# EAGLE design Left Ear Board (EAGLE 8.6.3)
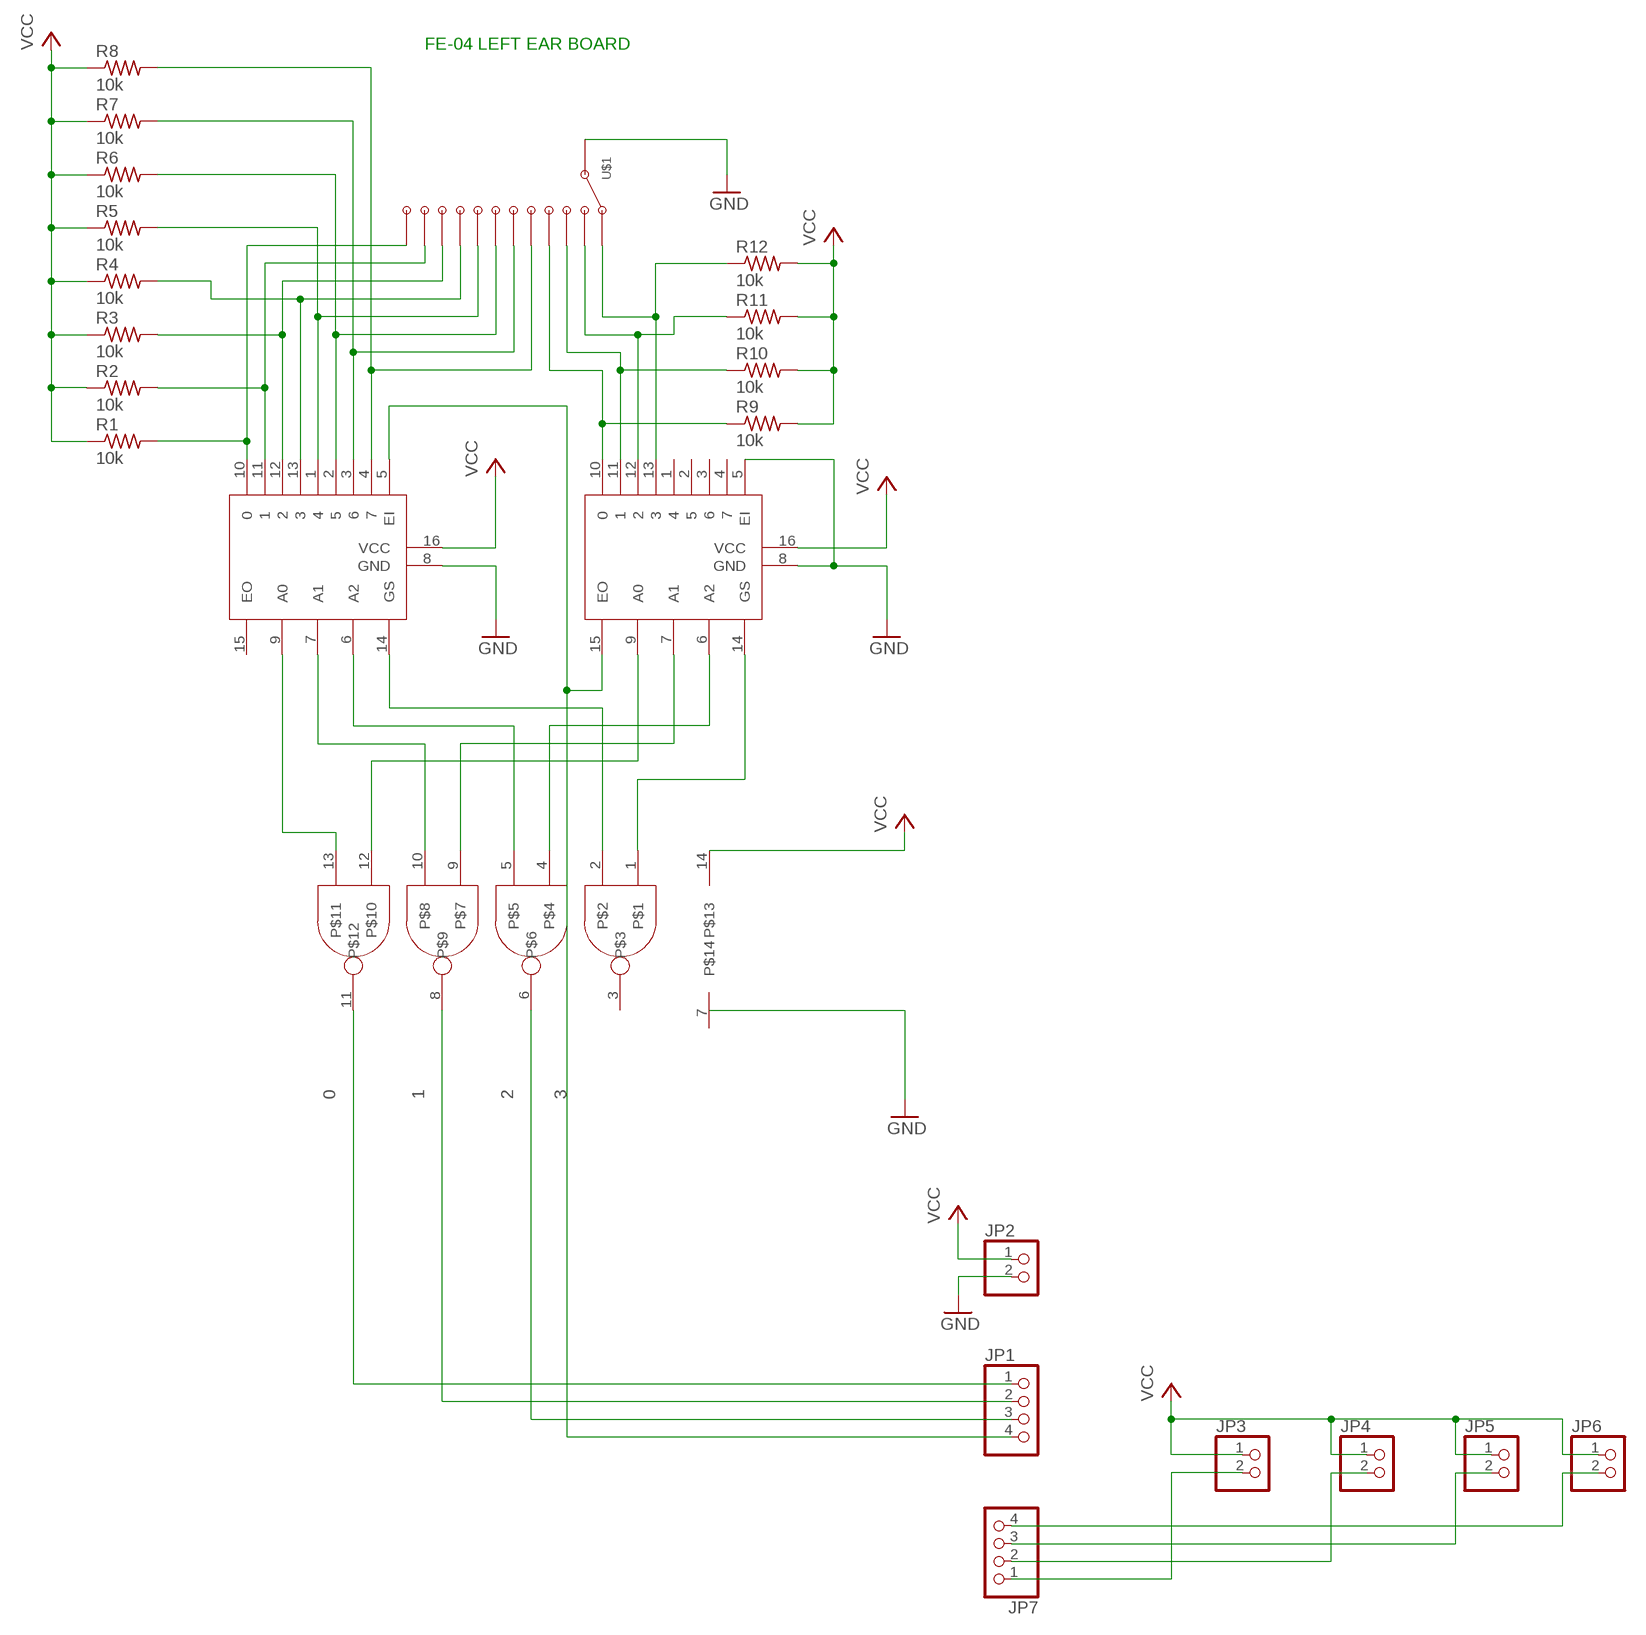
[diagram p0: schematic, sheet 1]

## Parts
JP1  PINHD-1X4  [1X04]
JP2  PINHD-1X2  [1X02]
JP3  PINHD-1X2  [1X02]
JP4  PINHD-1X2  [1X02]
JP5  PINHD-1X2  [1X02]
JP6  PINHD-1X2  [1X02]
JP7  PINHD-1X4  [1X04]
R1  10k  R-US_R0603  [R0603]
R2  10k  R-US_R0603  [R0603]
R3  10k  R-US_R0603  [R0603]
R4  10k  R-US_R0603  [R0603]
R5  10k  R-US_R0603  [R0603]
R6  10k  R-US_R0603  [R0603]
R7  10k  R-US_R0603  [R0603]
R8  10k  R-US_R0603  [R0603]
R9  10k  R-US_R0603  [R0603]
R10  10k  R-US_R0603  [R0603]
R11  10k  R-US_R0603  [R0603]
R12  10k  R-US_R0603  [R0603]
U$1  12-POSITION-ROTARY  [MC00L1NCQF]
U$2  SN74LS148D  [SOIC-16]
U$3  SN74LS148D  [SOIC-16]
U$4  QUAD_NAND  [SOIC-14]

## Nets
0: JP1.1 U$4.11
1: JP1.2 U$4.8
2: JP1.3 U$4.6
3: JP1.4 U$2.5(EI) U$3.15(EO)
GND: JP2.2 U$1.P$13(WIPER) U$2.8(GND) U$3.5(EI) U$3.8(GND)
N$1: R1.2 U$1.P$12(PIN12) U$2.10
N$2: U$2.9(A0) U$4.13
N$3: U$3.9(A0) U$4.12
N$4: U$2.7(A1) U$4.10
N$5: U$3.7(A1) U$4.9
N$6: U$2.6(A2) U$4.5
N$7: U$3.6(A2) U$4.4
N$8: U$2.14(GS) U$4.2
N$9: U$3.14(GS) U$4.1
N$10: R9.1 U$1.P$4(PIN4) U$3.10
N$11: R10.1 U$1.P$3(PIN3) U$3.11
N$12: R11.1 U$1.P$2(PIN2) U$3.12
N$13: R12.1 U$1.P$1(PIN1) U$3.13
N$14: R2.2 U$1.P$11(PIN11) U$2.11
N$15: R3.2 U$1.P$10(PIN10) U$2.12
N$16: R4.2 U$1.P$9(PIN9) U$2.13
N$17: R5.2 U$1.P$8(PIN8) U$2.1
N$18: R6.2 U$1.P$7(PIN7) U$2.2
N$19: R7.2 U$1.P$6(PIN6) U$2.3
N$20: R8.2 U$1.P$5(PIN5) U$2.4
N$21: JP3.2 JP7.1
N$22: JP4.2 JP7.2
N$23: JP5.2 JP7.3
N$24: JP6.2 JP7.4
VCC: JP2.1 JP3.1 JP4.1 JP5.1 JP6.1 R1.1 R2.1 R3.1 R4.1 R5.1 R6.1 R7.1 R8.1 R9.2 R10.2 R11.2 R12.2 U$2.16(VCC) U$3.16(VCC) U$4.14
Unconnected: U$2.15(EO) U$3.1 U$3.2 U$3.3 U$3.4 U$4.3 U$4.7

## Notes on the sheet
- FE-04 LEFT EAR BOARD

## Library data of the parts
JP1 JP7 = pinhead:PINHD-1X4: PIN HEADER
JP2-JP6 = pinhead:PINHD-1X2: PIN HEADER
R1-R12 = rcl:R-US_: RESISTOR, American symbol; PARTNO: ERJ-3EKF2201V
U$1 = FormE:12-POSITION-ROTARY: 12 Position Rotary Switch https://www.digikey.com/product-detail/en/c-k/MC00L1NCQF/CKN11089-ND/3754082
U$2 U$3 = FormE:SN74LS148D: IC PRIORITY ENCODER 8-3L 16-SOIC
U$4 = FormE:QUAD_NAND

## Board
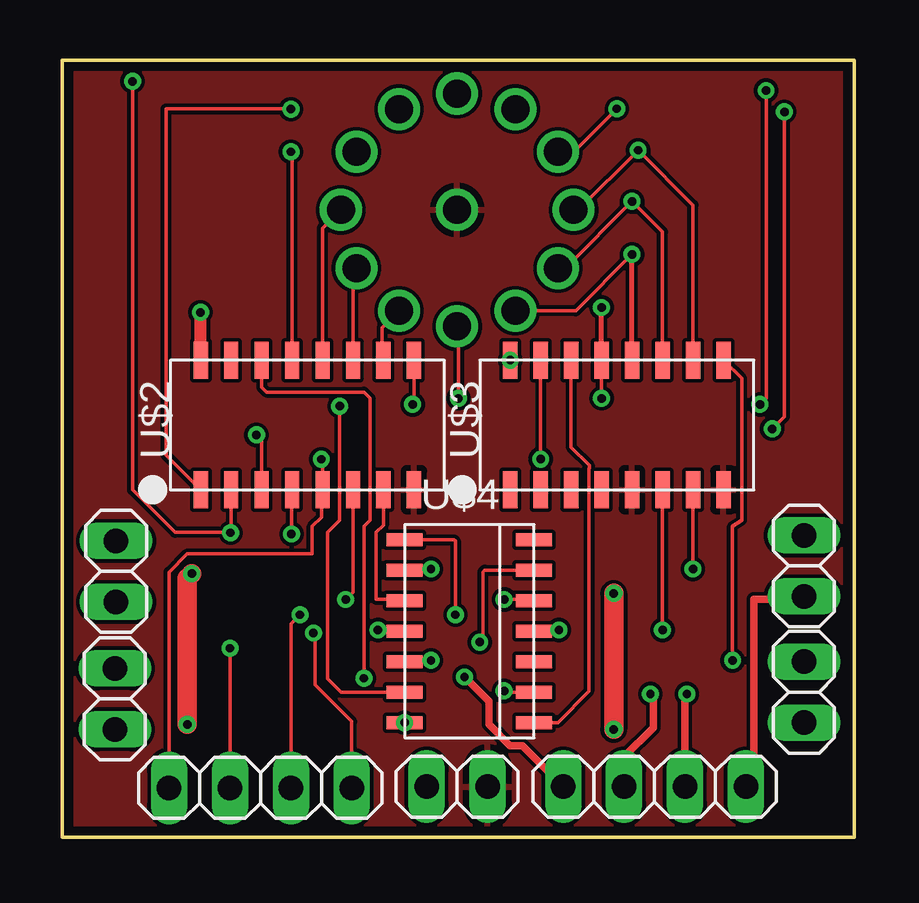
[diagram p1: board, top side]
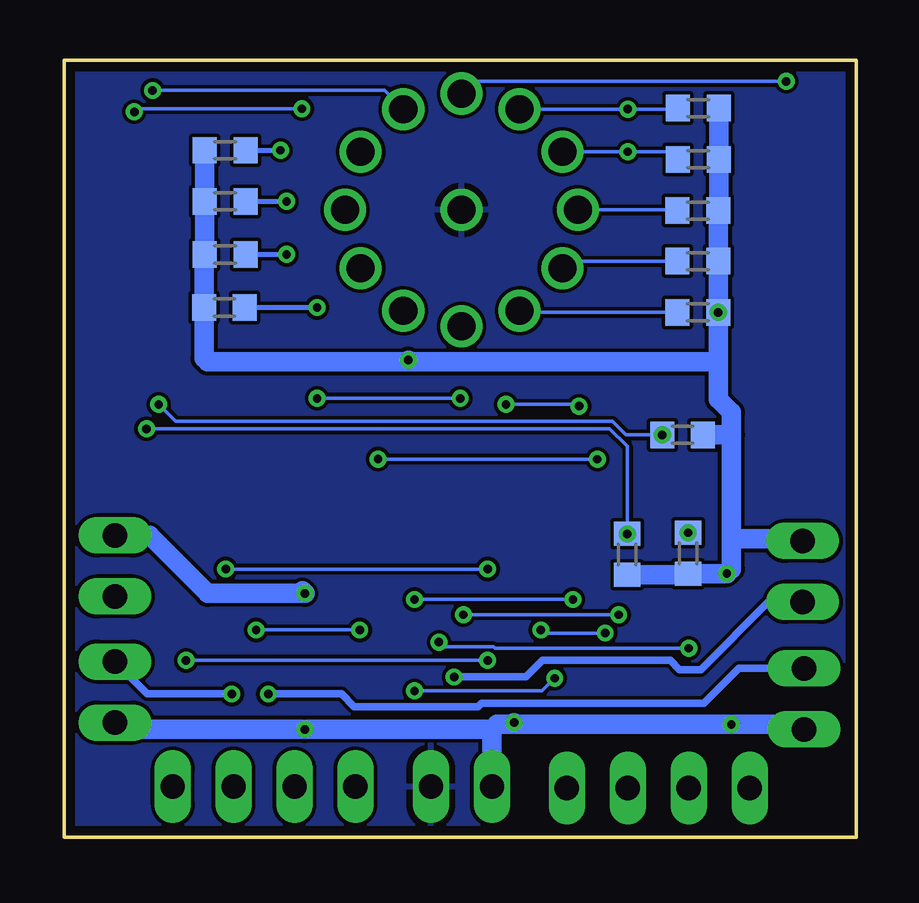
[diagram p2: board, bottom side, seen from below]

Size 33.02 x 32.38 mm. Coordinates in mm from the lower left corner, seen from the top.
Outline: 0,32.38 0,0 33.02,0 33.02,32.38 0,32.38
Copper layers (1*16): Top 0.0356mm / dielectric 1.5011mm / Bottom 0.0356mm
Design rules "OSH_PCB Rules": minimum track width 6mil, minimum drill 13mil, track to track 6mil, track to pad 6mil, pad to pad 6mil, via to via 6mil, smd to smd 6mil, copper to edge 15mil, drill to drill 6mil, minimum pad ring 7mil, minimum via ring 7mil, stop-mask expansion 3mil, vias tented up to drill 0mil, thermal gap 10mil

### Footprints (pad centres in the part's own frame; a part is rotated, then mirrored left to right if it is on the bottom)
1X04 = drill 1.016 long: 1 -3.81,0; 2 -1.27,0; 3 1.27,0; 4 3.81,0
1X02 = drill 1.016 long: 1 -1.27,0; 2 1.27,0
R0603 = smd 1 x 1.1: 1 -0.85,0; 2 0.85,0
MC00L1NCQF = drill 1.168: P$1 3.708,0.66; P$2 3.058,3.086; P$3 1.283,4.862; P$4 -1.143,5.512; P$5 -3.569,4.862; P$6 -5.344,3.086; P$7 -5.994,0.66; P$8 -5.344,-1.765; P$9 -3.569,-3.541; P$10 -1.143,-4.191; P$11 1.283,-3.541; P$12 3.058,-1.765; P$13 -1.143,0.66
SOIC-16 = smd 0.6 x 1.55: 1 0,0; 2 1.27,0; 3 2.54,0; 4 3.81,0; 5 5.08,0; 6 6.35,0; 7 7.62,0; 8 8.89,0; 9 8.89,5.4; 10 7.62,5.4; 11 6.35,5.4; 12 5.08,5.4; 13 3.81,5.4; 14 2.54,5.4; 15 1.27,5.4; 16 0,5.4
SOIC-14 = smd 0.55 x 1.5: 1 -3.81,-2.7; 2 -2.54,-2.7; 3 -1.27,-2.7; 4 0,-2.7; 5 1.27,-2.7; 6 2.54,-2.7; 7 3.81,-2.7; 8 3.81,2.7; 9 2.54,2.7; 10 1.27,2.7; 11 0,2.7; 12 -1.27,2.7; 13 -2.54,2.7; 14 -3.81,2.7

### Placement (x,y rotation side)
JP1  8.26,2.06 180 top
JP2  16.46,2.11 0 top
JP3  2.24,11.07 270 top
JP4  2.18,5.77 90 top
JP5  30.91,6.05 90 top
JP6  30.91,11.3 270 top
JP7  24.69,2.11 0 top
R1  6.6,21.87 180 bottom
R2  6.6,24 180 bottom
R3  6.6,26.11 180 bottom
R4  6.58,28.24 180 bottom
R5  6.58,30.38 180 bottom
R6  7.01,11.84 90 bottom
R7  7.24,16.76 180 bottom
R8  9.55,11.79 90 bottom
R9  26.31,28.63 180 bottom
R10  26.31,26.49 180 bottom
R11  26.31,24.28 180 bottom
R12  26.34,22.07 180 bottom
U$1  15.8,24.99 270 top
U$2  5.77,14.48 0 top
U$3  18.67,14.48 0 top
U$4  16.97,8.59 90 top

### Tracks (layer width: path | path; a pad name or v marks a point on that pad's centre or on a via)
0  (via drill 0.35)
  Top 0.152: JP1.1 12.06,4.83 10.54,6.35 10.54,8.44 v10.47,8.51 | v13.15,8.64 14.22,8.64 U$4.11
  Bottom 0.152: v10.47,8.51 13.03,8.51 v13.15,8.64
1  (via drill 0.35)
  Top 0.152: JP1.2 9.53,8.89 v9.91,9.27 | U$4.8 16.33,12.39 16.38,12.34 v16.38,9.27
  Bottom 0.152: v9.91,9.27 v16.38,9.27
2  (via drill 0.35)
  Top 0.152: JP1.3 v6.99,7.87 | v17.4,8.13 17.53,8.26 17.53,11.05 17.6,11.12 U$4.6
  Bottom 0.152: v6.99,7.87 15.05,7.87 15.13,7.95 17.22,7.95 v17.4,8.13
3  (via drill 0.35)
  Top 0.152: U$3.15 v19.94,15.76 19.94,15.75 | 10.79,14.53 U$2.5 | U$2.5 10.85,15.7 v10.79,15.75 | JP1.4 4.45,11.05 5.21,11.81 10.41,11.81 10.41,12.95 10.79,13.34 10.79,14.43 U$2.5
  Bottom 0.152: v10.79,15.75 19.93,15.75 v19.94,15.76
GND
  pour Top: -1.27,33.27 -1.27,-1.27 35.18,-1.27 35.18,33.66 -1.27,33.66
  pour Bottom: -0.64,33.02 -0.64,-0.64 33.78,-0.64 33.78,33.02
N$1
  Top 0.152: U$1.P$12 13.34,21.24 13.34,19.93 U$2.10
  Bottom 0.152: R1.2 11.81,21.87 11.94,21.87 13.97,21.87 U$1.P$12
N$2  (via drill 0.35)
  Top 0.152: U$2.9 14.66,18.09 v14.61,18.03 | U$4.13 11.61,6.04 11.05,6.6 11.05,12.7 11.56,13.21 v11.56,17.96
  Bottom 0.152: v14.61,18.03 11.63,18.03 v11.56,17.96
N$3  (via drill 0.35)
  Top 0.152: U$4.12 v15.37,7.37 | v27.94,7.37 27.94,12.95 28.32,13.21 28.32,19.12 U$3.9
  Bottom 0.152: v15.37,7.37 v27.94,7.37
N$4
  Top 0.152: U$4.10 14.22,9.91 13.08,9.91 13.08,12.7 13.39,13.01 U$2.7
N$5  (via drill 0.35)
  Top 0.152: U$4.9 15.32,11.12 v15.37,11.18 | v26.29,11.18 U$3.7
  Bottom 0.152: v15.37,11.18 v26.29,11.18
N$6  (via drill 0.35)
  Top 0.152: U$2.6 12.12,10.21 v11.81,9.91 | v18.41,9.91 19.62,9.91 U$4.5
  Bottom 0.152: v11.81,9.91 v18.41,9.91
N$7  (via drill 0.35)
  Top 0.152: U$3.6 v25.02,8.64 | v20.7,8.64 19.72,8.64 U$4.4
  Bottom 0.152: v25.02,8.64 v20.7,8.64
N$8  (via drill 0.35)
  Top 0.152: U$2.14 8.31,18.75 8.51,18.54 12.57,18.54 12.83,18.29 12.83,13.21 12.57,12.95 v12.57,6.63 | U$4.2 18.47,6.04 v18.41,6.1
  Bottom 0.152: v18.41,6.1 13.1,6.1 v12.57,6.63
N$9
  Top 0.152: U$3.14 21.21,16.26 21.97,15.49 21.97,15.37 21.95,15.35 21.95,6.08 20.65,4.78 U$4.1
N$10  (via drill 0.35)
  Top 0.152: U$3.10 26.29,26.34 v24,28.63 21.51,26.14 U$1.P$4
  Bottom 0.203: R9.1 v24,28.63
N$11  (via drill 0.35)
  Top 0.152: U$3.11 25.02,25.22 v23.75,26.49 20.97,23.71 U$1.P$3
  Bottom 0.203: R10.1 v23.75,26.49
N$12  (via drill 0.35)
  Top 0.152: v23.75,24.28 21.4,21.93 U$1.P$2
  Top 0.203: U$3.12 v23.75,24.28
  Bottom 0.203: R11.1 v23.75,24.28
N$13  (via drill 0.35)
  Top 0.152: U$1.P$1 16.51,21.23 v16.51,18.29 | v22.48,18.29 U$3.13
  Top 0.203: U$3.13 v22.48,22.07
  Bottom 0.152: v16.51,18.29 v22.48,18.29
  Bottom 0.203: R12.1 v22.48,22.07
N$14
  Top 0.152: U$2.11 12.12,23.57 U$1.P$11
  Bottom 0.152: U$1.P$11 11.97,24 R2.2
N$15
  Top 0.152: U$2.12 10.85,25.38 U$1.P$10
  Bottom 0.152: U$1.P$10 7.48,26.14 R3.2
N$16  (via drill 0.35)
  Top 0.152: U$2.13 9.58,28.51 v9.53,28.56
  Bottom 0.152: U$1.P$9 v9.53,28.56 7.75,28.56 R4.2
N$17  (via drill 0.35)
  Top 0.152: v9.53,30.34 9.51,30.35 4.32,30.35 4.32,15.93 U$2.1
  Bottom 0.152: U$1.P$8 v9.53,30.34 7.47,30.34 R5.2
N$18  (via drill 0.35)
  Top 0.152: U$2.2 7.04,12.71 7.02,12.7 | 7.02,12.7 R6.2 | 7.02,12.7 4.7,12.7 2.92,14.48 v2.92,31.5
  Bottom 0.152: v2.92,31.5 16.38,31.5 16.38,31.06 U$1.P$7
  other vias: 7.01,12.69
N$19  (via drill 0.35)
  Top 0.152: U$2.3 8.31,16.55 R7.2 | v29.08,18.03 29.34,18.29 v29.34,31.11
  Bottom 0.152: v29.08,18.03 28.37,17.32 10.16,17.32 9.6,16.76 R7.2 | v29.34,31.11 19.66,31.11 U$1.P$6
  other vias: 8.09,16.76
N$20  (via drill 0.35)
  Top 0.152: R8.2 9.55,14.45 U$2.4 | v30.1,30.23 30.1,17.53 v29.59,17.02 | U$1.P$5 21.32,28.56 v23.11,30.35
  Bottom 0.152: v29.59,17.02 10.29,17.02 9.55,16.28 R8.2 | v23.11,30.35 29.97,30.35 v30.1,30.23
  other vias: 9.55,12.64
N$21  (via drill 0.35)
  Top 0.305: JP7.1 19.18,3.81 18.67,3.81 17.78,4.7 17.78,5.66 v16.76,6.68
  Bottom 0.305: v16.76,6.68 13.77,6.68 13.08,7.37 7.75,7.37 7.37,6.99 6.48,6.99 3.66,9.8 JP3.2
N$22  (via drill 0.35)
  Top 0.305: JP7.2 23.42,3.35 24.64,4.57 24.64,5.84 v24.51,5.97
  Bottom 0.305: v24.51,5.97 21.46,5.97 20.93,5.44 15.77,5.44 15.62,5.59 6.35,5.59 4.9,7.04 JP4.2
N$23  (via drill 0.35)
  Top 0.305: v26.04,5.97 25.96,5.89 JP7.3
  Bottom 0.305: JP5.2 29.57,5.97 v26.04,5.97
N$24
  Top 0.305: 28.73,2.33 JP7.4 | 28.7,2.31 JP7.4 | JP6.2 30.79,9.91 28.83,9.91 28.83,2.44 JP7.4
VCC  (via drill 0.35)
  Top 0.508: U$2.16 5.77,21.86 R1.1
  Top 0.813: v5.21,4.7 5.21,10.8 v5.4,10.99 | v22.99,10.16 v22.99,4.5
  Bottom 0.813: R5.1 R4.1 5.73,26.14 R3.1 R2.1 R1.1 5.75,19.81 | R9.2 R10.2 R11.2 27.19,24.26 R12.2 27.19,19.95 27.05,19.81 18.67,19.81 | R8.1 7.06,10.94 R6.1 v5.4,10.99 5.21,11.18 5.21,12.45 | 5.75,19.81 5.75,18.25 5.21,17.7 5.21,16.76 | 18.67,19.81 5.75,19.81 | 5.21,12.45 5.21,16.76 | U$3.16 18.67,19.81 | R7.1 5.21,16.76 | JP2.1 15.19,4.5 | 15.19,4.5 14.99,4.7 14.22,4.7 | 14.22,4.7 v5.21,4.7 2.39,4.7 JP4.1 | U$4.14 14.27,4.74 14.22,4.7 | 15.19,4.5 v22.99,4.5 30.63,4.5 JP5.1 | 23.09,10.26 v22.99,10.16 27.05,10.16 29.46,12.57 JP6.1 | 5.21,12.45 2.34,12.45 JP3.1
  other vias: 5.75,21.87 18.67,19.88 14.27,4.78